# Altium schematic sheet Schematic_Sheet.SchDoc
size A3; SheetNumber: 1; SheetTotal: 1
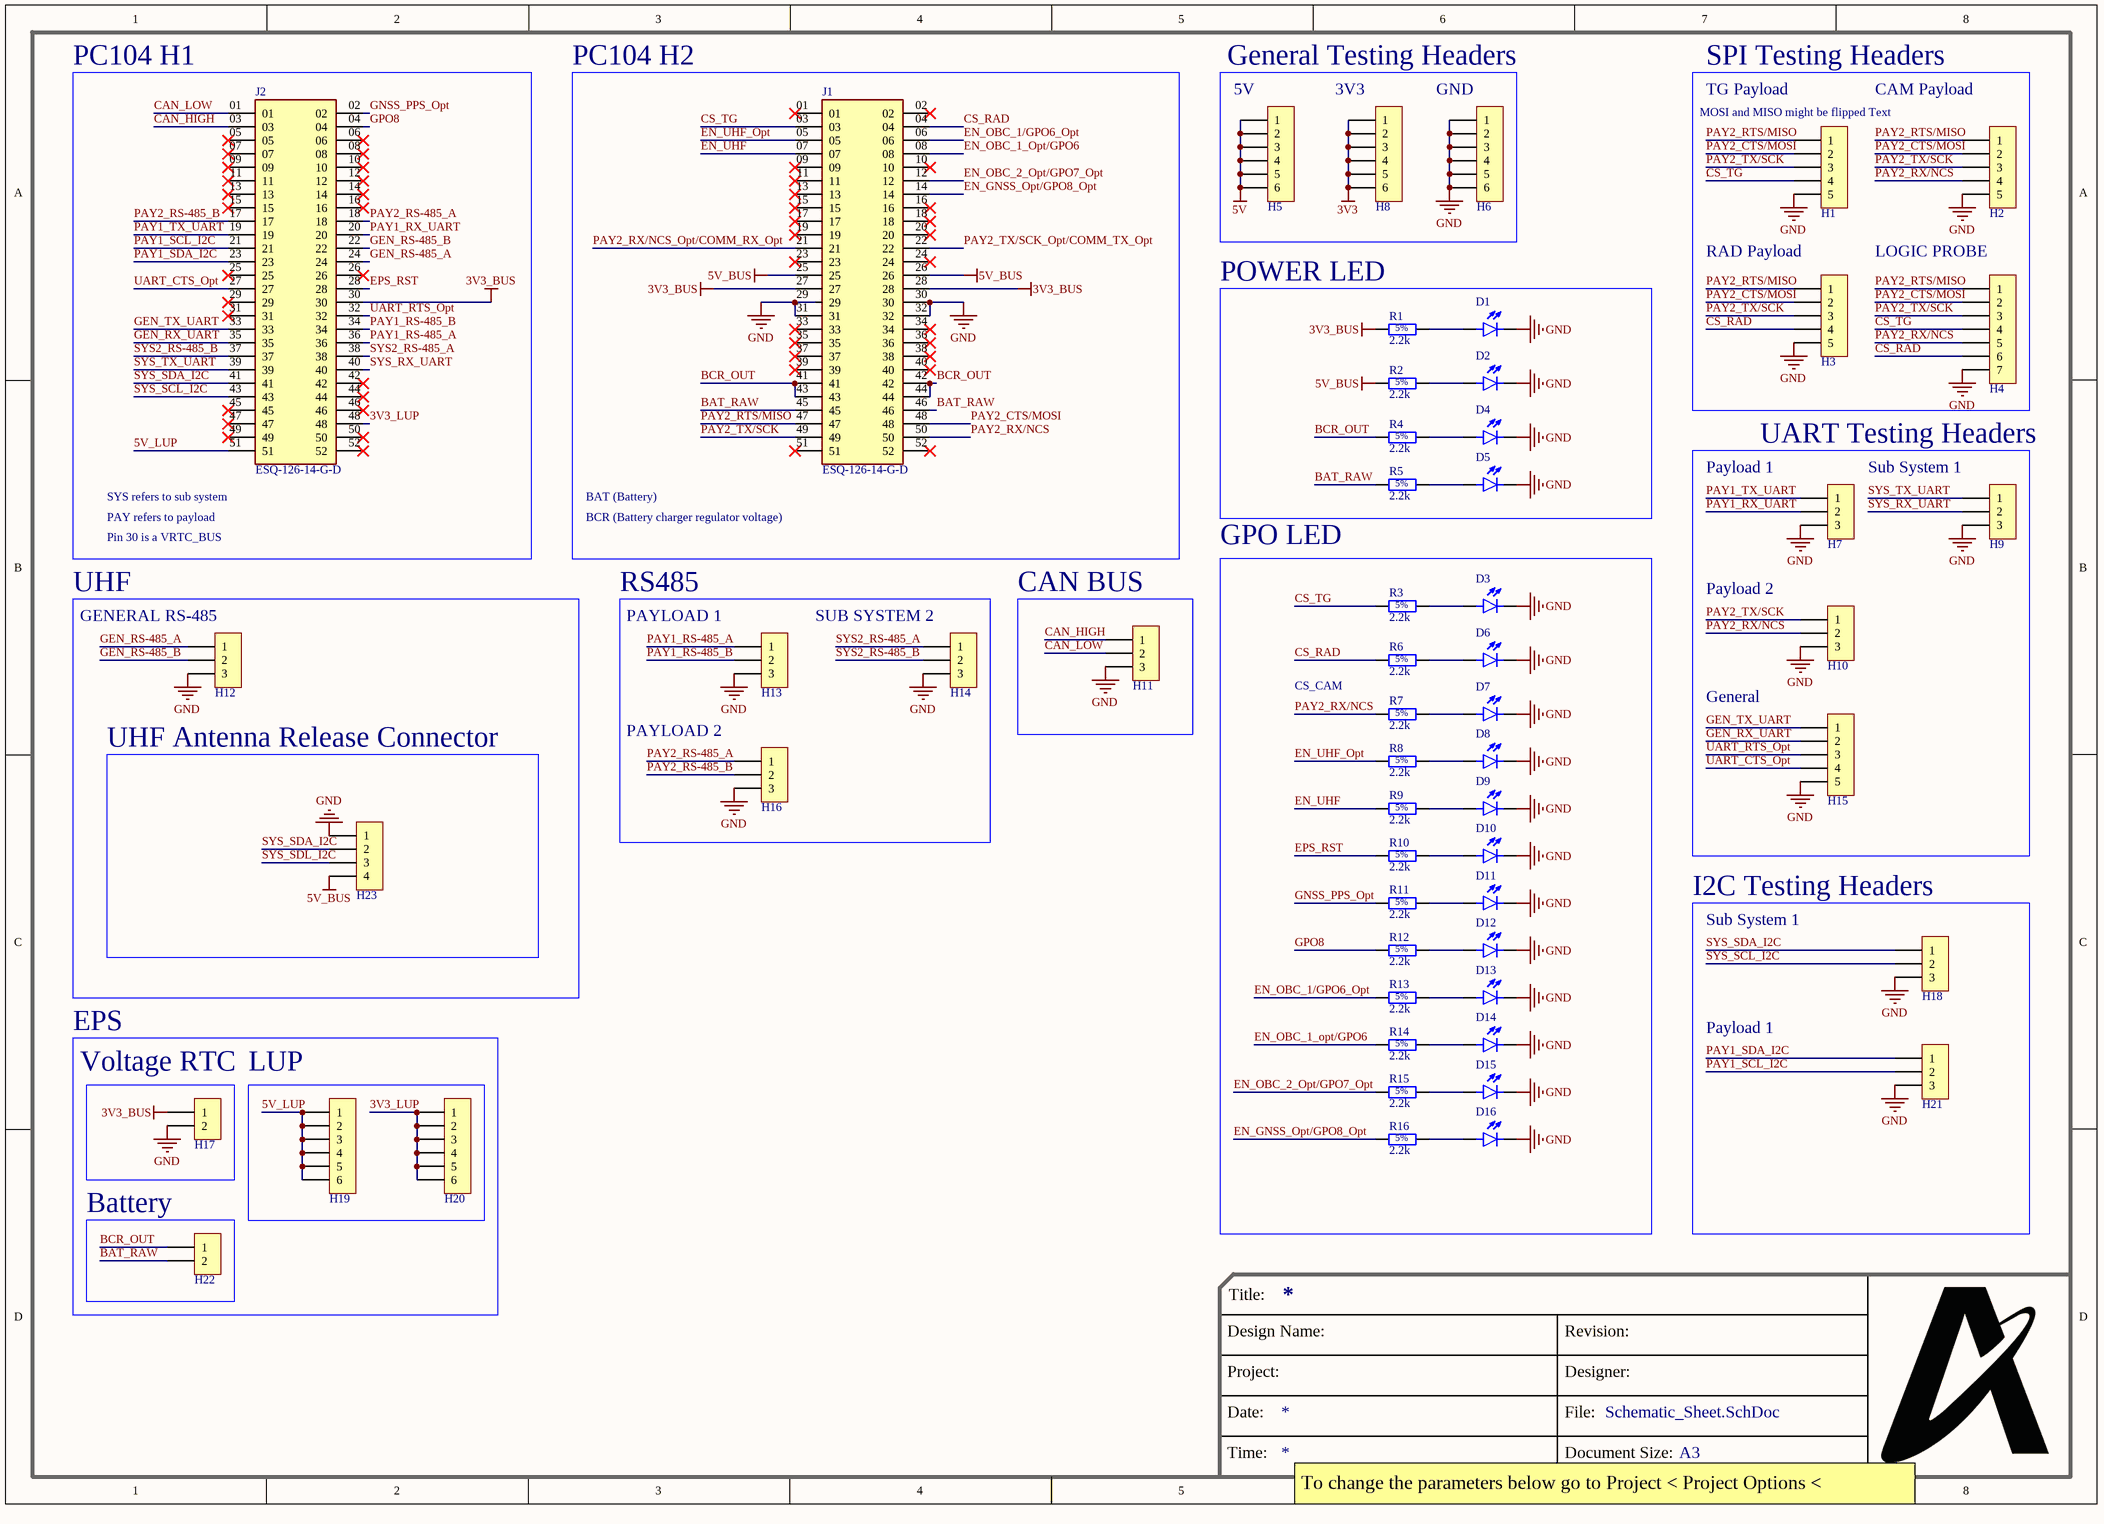
[diagram p0: Schematic_Sheet.SchDoc]

## Parts
D1  LTST-C190 Series  [LED_0603_1608M_0.80mm]  (value not drawn)
D2  LTST-C190 Series  [LED_0603_1608M_0.80mm]  (value not drawn)
D3  LTST-C190 Series  [LED_0603_1608M_0.80mm]  (value not drawn)
D4  LTST-C190 Series  [LED_0603_1608M_0.80mm]  (value not drawn)
D5  LTST-C190 Series  [LED_0603_1608M_0.80mm]  (value not drawn)
D6  LTST-C190 Series  [LED_0603_1608M_0.80mm]  (value not drawn)
D7  LTST-C190 Series  [LED_0603_1608M_0.80mm]  (value not drawn)
D8  LTST-C190 Series  [LED_0603_1608M_0.80mm]  (value not drawn)
D9  LTST-C190 Series  [LED_0603_1608M_0.80mm]  (value not drawn)
D10  LTST-C190 Series  [LED_0603_1608M_0.80mm]  (value not drawn)
D11  LTST-C190 Series  [LED_0603_1608M_0.80mm]  (value not drawn)
D12  LTST-C190 Series  [LED_0603_1608M_0.80mm]  (value not drawn)
D13  LTST-C190 Series  [LED_0603_1608M_0.80mm]  (value not drawn)
D14  LTST-C190 Series  [LED_0603_1608M_0.80mm]  (value not drawn)
D15  LTST-C190 Series  [LED_0603_1608M_0.80mm]  (value not drawn)
D16  LTST-C190 Series  [LED_0603_1608M_0.80mm]  (value not drawn)
H1  HDR,2.54mm,1x5  [HEADER_2.54MM_1x5PIN]  (value not drawn)  (no BOM)
H2  HDR,2.54mm,1x5  [HEADER_2.54MM_1x5PIN]  (value not drawn)  (no BOM)
H3  HDR,2.54mm,1x5  [HEADER_2.54MM_1x5PIN]  (value not drawn)  (no BOM)
H4  HDR,2.54mm,1x7  [HEADER_2.54MM_1x7PIN]  (value not drawn)  (no BOM)
H5  HDR,2.54mm,1x6  [HEADER_2.54MM_1x6PIN]  (value not drawn)  (no BOM)
H6  HDR,2.54mm,1x6  [HEADER_2.54MM_1x6PIN]  (value not drawn)  (no BOM)
H7  HDR,2.54mm,1x3  [HEADER_2.54MM_1x3PIN]  (value not drawn)  (no BOM)
H8  HDR,2.54mm,1x6  [HEADER_2.54MM_1x6PIN]  (value not drawn)  (no BOM)
H9  HDR,2.54mm,1x3  [HEADER_2.54MM_1x3PIN]  (value not drawn)  (no BOM)
H10  HDR,2.54mm,1x3  [HEADER_2.54MM_1x3PIN]  (value not drawn)  (no BOM)
H11  HDR,2.54mm,1x3  [HEADER_2.54MM_1x3PIN]  (value not drawn)  (no BOM)
H12  HDR,2.54mm,1x3  [HEADER_2.54MM_1x3PIN]  (value not drawn)  (no BOM)
H13  HDR,2.54mm,1x3  [HEADER_2.54MM_1x3PIN]  (value not drawn)  (no BOM)
H14  HDR,2.54mm,1x3  [HEADER_2.54MM_1x3PIN]  (value not drawn)  (no BOM)
H15  HDR,2.54mm,1x5  [HEADER_2.54MM_1x5PIN]  (value not drawn)  (no BOM)
H16  HDR,2.54mm,1x3  [HEADER_2.54MM_1x3PIN]  (value not drawn)  (no BOM)
H17  HDR,2.54mm,1x2  [HEADER_2.54MM_1x2PIN]  (value not drawn)  (no BOM)
H18  HDR,2.54mm,1x3  [HEADER_2.54MM_1x3PIN]  (value not drawn)  (no BOM)
H19  HDR,2.54mm,1x6  [HEADER_2.54MM_1x6PIN]  (value not drawn)  (no BOM)
H20  HDR,2.54mm,1x6  [HEADER_2.54MM_1x6PIN]  (value not drawn)  (no BOM)
H21  HDR,2.54mm,1x3  [HEADER_2.54MM_1x3PIN]  (value not drawn)  (no BOM)
H22  HDR,2.54mm,1x2  [HEADER_2.54MM_1x2PIN]  (value not drawn)  (no BOM)
H23  HDR,2.54mm,1x4  [HEADER_2.54MM_1x4PIN]  (value not drawn)  (no BOM)
J1  ESQ-126-14-G-D  [SAMTEC_ESQ-126-14-G-D]
J2  ESQ-126-14-G-D  [SAMTEC_ESQ-126-14-G-D]
R1  2.2k  [RESISTOR_0805_2012M-50N]
R2  2.2k  [RESISTOR_0805_2012M-50N]
R3  2.2k  [RESISTOR_0805_2012M-50N]
R4  2.2k  [RESISTOR_0805_2012M-50N]
R5  2.2k  [RESISTOR_0805_2012M-50N]
R6  2.2k  [RESISTOR_0805_2012M-50N]
R7  2.2k  [RESISTOR_0805_2012M-50N]
R8  2.2k  [RESISTOR_0805_2012M-50N]
R9  2.2k  [RESISTOR_0805_2012M-50N]
R10  2.2k  [RESISTOR_0805_2012M-50N]
R11  2.2k  [RESISTOR_0805_2012M-50N]
R12  2.2k  [RESISTOR_0805_2012M-50N]
R13  2.2k  [RESISTOR_0805_2012M-50N]
R14  2.2k  [RESISTOR_0805_2012M-50N]
R15  2.2k  [RESISTOR_0805_2012M-50N]
R16  2.2k  [RESISTOR_0805_2012M-50N]

## Blocks framed on the sheet
PC104 H1: J2
PC104 H2: J1
General Testing Headers: H5 H6 H8
SPI Testing Headers: H1-H4
POWER LED: D1 D2 D4 D5 R1 R2 R4 R5
UART Testing Headers: H7 H9 H10 H15
GPO LED: D3 D6-D16 R3 R6-R16
UHF: H12
RS485: H13 H14 H16
CAN BUS: H11
UHF Antenna Release Connector: H23
I2C Testing Headers: H18 H21
LUP: H19 H20
Battery: H22

## Nets
3V3: H8.1 H8.2 H8.3 H8.4 H8.5 H8.6
3V3_BUS: H17.1 J1.27 J1.28 J2.30 R1.1
5V: H5.1 H5.2 H5.3 H5.4 H5.5 H5.6
5V_BUS: H23.4 J1.25 J1.26 R2.1
GND: D1.C D2.C D3.C D4.C D5.C D6.C D7.C D8.C D9.C D10.C D11.C D12.C D13.C D14.C D15.C D16.C H1.5 H2.5 H3.5 H4.7 H6.1 H6.2 H6.3 H6.4 H6.5 H6.6 H7.3 H9.3 H10.3 H11.3 H12.3 H13.3 H14.3 H15.5 H16.3 H17.2 H18.3 H21.3 H23.1 J1.29 J1.30 J1.31 J1.32
3V3_LUP: H20.1 H20.2 H20.3 H20.4 H20.5 H20.6 J2.48
5V_LUP: H19.1 H19.2 H19.3 H19.4 H19.5 H19.6 J2.51
.: H1.4 H4.4 J1.03 R3.1  [also labelled CS_TG]
BAT_RAW: H22.2 J1.45 J1.46 R5.1
BCR_OUT: H22.1 J1.41 J1.42 J1.43 J1.44 R4.1
CAN_HIGH: H11.1 J2.03
CAN_LOW: H11.2 J2.01
CS_RAD: H3.4 H4.6 J1.04 R6.1
EN_GNSS_Opt/GPO8_Opt: J1.14 R16.1
EN_OBC_1/GPO6_Opt: J1.06 R13.1
EN_OBC_1_Opt/GPO6: J1.08 R14.1
EN_OBC_2_Opt/GPO7_Opt: J1.12 R15.1
EN_UHF: J1.07 R9.1  [also labelled EN_UHF ]
EN_UHF_Opt: J1.05 R8.1
EPS_RST: J2.28 R10.1
GEN_RS-485_A: H12.1 J2.24
GEN_RS-485_B: H12.2 J2.22
GEN_RX_UART: H15.2 J2.35
GEN_TX_UART: H15.1 J2.33
GNSS_PPS_Opt: J2.02 R11.1
GPO8: J2.04 R12.1
PAY1_RS-485_A: H13.1 J2.36
PAY1_RS-485_B: H13.2 J2.34
PAY1_RX_UART: H7.2 J2.20
PAY1_SCL_I2C: H21.2 J2.21
PAY1_SDA_I2C: H21.1 J2.23
PAY1_TX_UART: H7.1 J2.19
PAY2_CTS/MOSI: H1.2 H2.2 H3.2 H4.2 J1.48
PAY2_RS-485_A: H16.1 J2.18
PAY2_RS-485_B: H16.2 J2.17
PAY2_RTS/MISO: H1.1 H2.1 H3.1 H4.1 J1.47
PAY2_RX/NCS: H2.4 H4.5 H10.2 J1.50 R7.1
PAY2_RX/NCS_Opt/COMM_RX_Opt: J1.21
PAY2_TX/SCK: H1.3 H2.3 H3.3 H4.3 H10.1 J1.49
PAY2_TX/SCK_Opt/COMM_TX_Opt: J1.22
SYS2_RS-485_A: H14.1 J2.38
SYS2_RS-485_B: H14.2 J2.37
SYS_RX_UART: H9.2 J2.40
SYS_SCL_I2C: H18.2 J2.43
SYS_SDA_I2C: H18.1 H23.2 J2.41
SYS_SDL_I2C: H23.3
SYS_TX_UART: H9.1 J2.39
UART_CTS_Opt: H15.4 J2.27
UART_RTS_Opt: H15.3 J2.32
NetD1_A: D1.A R1.2
NetD2_A: D2.A R2.2
NetD3_A: D3.A R3.2
NetD4_A: D4.A R4.2
NetD5_A: D5.A R5.2
NetD6_A: D6.A R6.2
NetD7_A: D7.A R7.2
NetD8_A: D8.A R8.2
NetD9_A: D9.A R9.2
NetD10_A: D10.A R10.2
NetD11_A: D11.A R11.2
NetD12_A: D12.A R12.2
NetD13_A: D13.A R13.2
NetD14_A: D14.A R14.2
NetD15_A: D15.A R15.2
NetD16_A: D16.A R16.2

Not connected (* = marked no-connect by the designer): J1 01* 02* 09* 10* 11* 13* 15* 16* 17* 18* 19* 20* 23* 24* 33* 34* 35* 36* 37* 38* 39* 40* 51* 52*; J2 05* 06* 07* 08* 09* 10* 11* 12* 13* 14* 15* 16* 25* 26* 29* 31* 42* 44* 45* 46* 47* 49* 50* 52*

## Notes on the sheet
- (near H5) 5V
- (near H8) 3V3
- (near H6) GND
- (near H1) TG Payload
- CAM Payload
- (near H1) MOSI and MISO might be flipped Text
- RAD Payload
- LOGIC PROBE
- (near J2) SYS refers to sub system
- BAT (Battery)
- (near H7) Payload 1
- Sub System 1
- PAY refers to payload
- Pin 30 is a VRTC_BUS
- BCR (Battery charger regulator voltage)
- (near H12) GENERAL RS-485
- PAYLOAD 1
- SUB SYSTEM 2
- Payload 2
- CS_CAM
- General
- PAYLOAD 2
- EPS
- Payload 1
- (near H17) Voltage RTC
- To change the parameters below go to Project < Project Options < Parameters
- Title:
- Design Name:
- Project:
- Revision:
- Designer:
- Date:
- Time:
- File:
- Document Size:
- A3

## Library data of the parts
D1-D16 = LTST-C190 Series: Diode - LED, 0603; APSS Standard Part: APSS Standard; Temp Range: -30°C ~ 85°C; Rated Voltage: 5V Reverse; Package: 0603; Supplier 1: Digikey
H1-H3 H15 = HDR,2.54mm,1x5: Connector - 2.54mm, 1x5-pin
H4 = HDR,2.54mm,1x7: Connector - 2.54mm, 1x7-pin
H5 H6 H8 H19 H20 = HDR,2.54mm,1x6: Connector - 2.54mm, 1x6-pin
H7 H9-H14 H16 H18 H21 = HDR,2.54mm,1x3: Connector - 2.54mm, 1x3-pin
H17 H22 = HDR,2.54mm,1x2: Connector - 2.54mm, 1x2-pin
H23 = HDR,2.54mm,1x4: Connector - 2.54mm, 1x4-pin
J1 J2 = ESQ-126-14-G-D: MF: Samtec; MP: ESQ-126-14-G-D; Price: None; Package: None; Value: *; Availability: Unavailable
R1-R16 = Generic Resistor: Passive - Resistor, Generic; Tolerance: 5%; Value: 2.2k